# Altium schematic sheet USB to SPI.SchDoc
size E
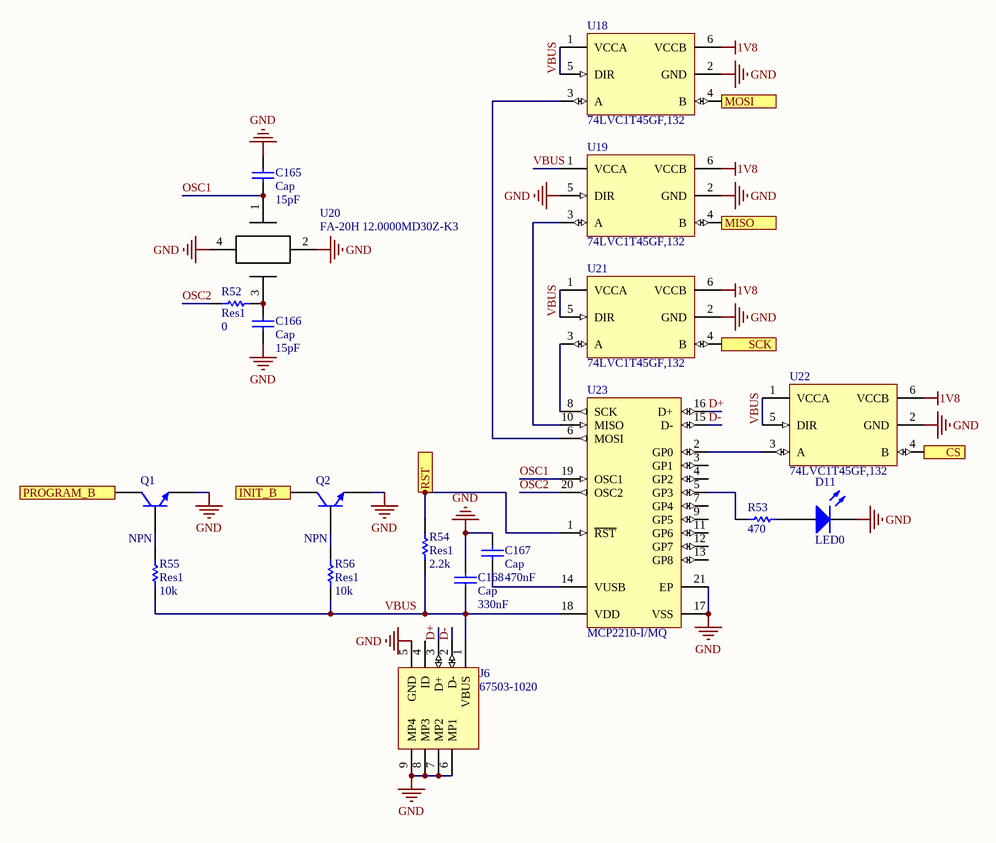
[diagram p0: USB to SPI.SchDoc]

## Parts
C165  Cap  value 15pF  [0402-A]
C166  Cap  value 15pF  [0402-A]
C167  Cap  value 470nF  [0402-A]
C168  Cap  value 330nF  [0402-A]
D11  LED0  [1608[0603]]
J6  67503-1020  [MOLX-67503-1020_V]
Q1  NPN  [SOT23_M]
Q2  NPN  [SOT23_M]
R52  Res1  value 0  [0402-A]
R53  value 470  [0402-A]  (hidden comment: Res1)
R54  Res1  value 2.2k  [0402-A]
R55  Res1  value 10k  [0402-A]
R56  Res1  value 10k  [0402-A]
U18  74LVC1T45GF,132  [74LVC1T45GF,132]
U19  74LVC1T45GF,132  [74LVC1T45GF,132]
U20  FA-20H 12.0000MD30Z-K3  [FA-20H 12.0000MD30Z-K3]
U21  74LVC1T45GF,132  [74LVC1T45GF,132]
U22  74LVC1T45GF,132  [74LVC1T45GF,132]
U23  MCP2210-I/MQ  [QFN-MQ20_L]

## Ports
CS (out), INIT_B (out), MISO (in), MOSI (out), PROGRAM_B (out), RST (in), SCK (out)

## Nets
1V8: U18.6(VCCB) U19.6(VCCB) U21.6(VCCB) U22.6(VCCB)
GND: C165.1 C166.2 C167.1 C168.1 D11.2(K) J6.5(GND) J6.6(MP1) J6.7(MP2) J6.8(MP3) J6.9(MP4) Q1.3(E) Q2.3(E) U18.2(GND) U19.2(GND) U19.5(DIR) U20.2 U20.4 U21.2(GND) U22.2(GND) U23.17(VSS) U23.21(EP)
CS: U22.4(B) ; port CS
D+: J6.3(D+) U23.16(D+)
D-: J6.2(D-) U23.15(D-)
INIT_B: Q2.1(C) ; port INIT_B
MISO: U19.4(B) ; port MISO
MOSI: U18.4(B) ; port MOSI
OSC1: C165.2 U20.1 U23.19(OSC1)
OSC2: R52.2 U23.20(OSC2)
PROGRAM_B: Q1.1(C) ; port PROGRAM_B
RST: R54.2 U23.1(~{RST}) ; port RST
SCK: U21.4(B) ; port SCK
VBUS: C168.2 J6.1(VBUS) R54.1 R55.1 R56.1 U18.1(VCCA) U18.5(DIR) U19.1(VCCA) U21.1(VCCA) U21.5(DIR) U22.1(VCCA) U22.5(DIR) U23.18(VDD)
NetC166_1: C166.1 R52.1 U20.3
NetC167_2: C167.2 U23.14(VUSB)
NetD11_1: D11.1(A) R53.1
NetQ1_2: Q1.2(B) R55.2
NetQ2_2: Q2.2(B) R56.2
NetR53_2: R53.2 U23.5(GP3)
NetU18_3: U18.3(A) U23.6(MOSI)
NetU19_3: U19.3(A) U23.10(MISO)
NetU21_3: U21.3(A) U23.8(SCK)
NetU22_3: U22.3(A) U23.2(GP0)

Not connected (* = marked no-connect by the designer): J6 4(ID); U23 3(GP1) 4(GP2) 7(GP4) 9(GP5) 11(GP6) 12(GP7) 13(GP8)

## Library data of the parts
C165-C168 = Cap: Capacitor; Published: 8-Jun-2000; LatestRevisionDate: 17-Jul-2002; LatestRevisionNote: Re-released for DXP Platform.; PackageReference: RAD-0.3; Publisher: Altium Limited; PackageDescription: Radial Cap, Thru-Hole; 2 Leads; 0.3 in Pin Spacing
J6 = CMP-0411-00002-1: USB, MINI, SMD, RA KME04-USBMU03A01; Manufacturer: Molex; ComponentLink1URL: http://www.molex.com/; PartNumber: 67503-1020; Mounting Technology: Surface Mount; ComponentLink1Description: Manufacturer URL; Terminal Pitch: 0.8 mm; DatasheetVersion: Rev F, 06/2009; ComponentLink2Description: Datasheet; PackageDescription: Mini USB Connector, SMT, Righer Angle; ComponentLink2URL: http://www.molex.com/pdm_docs/sd/675031020_sd.pdf; PackageReference: 67503-1020
Q1 Q2 = NPN: NPN Bipolar Transistor; Published: 8-Jun-2000; LatestRevisionDate: 17-Jul-2002; LatestRevisionNote: Re-released for DXP Platform.; PackageReference: TO-226-AA; Publisher: Altium Limited; PackageDescription: TO, Flat Index; 3 In-Line, Axial Leads; Body Dia. 4.8mm; Leads 0.55 x 0.51 mm (max); Code_JEDEC: TO-226-AA
R52-R56 = Res1: Resistor; Published: 8-Jun-2000; LatestRevisionDate: 17-Jul-2002; LatestRevisionNote: Re-released for DXP Platform.; PackageReference: AXIAL-0.3; Publisher: Altium Limited; PackageDescription: Axial Device, Thru-Hole; 2 Leads; 0.3 in Pin Spacing
U20 = XRCGB32M000F1H00R0
U23 = CMP-0186-00190-1: USB-to-SPI Protocol Converter with GPIO (Master Mode), 20-Pin QFN, Industrial Temperature; PackageVersion: revBB, Aug-2009; ComponentLink3URL: http://www.microchip.com/stellent/groups/techpub_sg/documents/packagingspec/en012702.pdf; ComponentLink1Description: Manufacturer URL; ComponentLink1URL: http://www.microchip.com/; ComponentLink3Description: Package Specification; ComponentLink2URL: http://ww1.microchip.com/downloads/en/DeviceDoc/22288A.pdf; DatasheetVersion: revA, Dec-2011; ComponentLink2Description: Datasheet; PackageReference: QFN-MQ20; PackageDescription: 20-Lead Plastic Quad Flat, No Lead Package (MQ) - 5x5x0.9 mm Body [QFN]
D11 = LED0: Published: 8-Jun-2000; LatestRevisionDate: 08-Jul-2005; LatestRevisionNote: Mech Layer 1 removed.; PackageReference: LED-0; Publisher: Altium Limited; PackageDescription: LED; 2 Leads